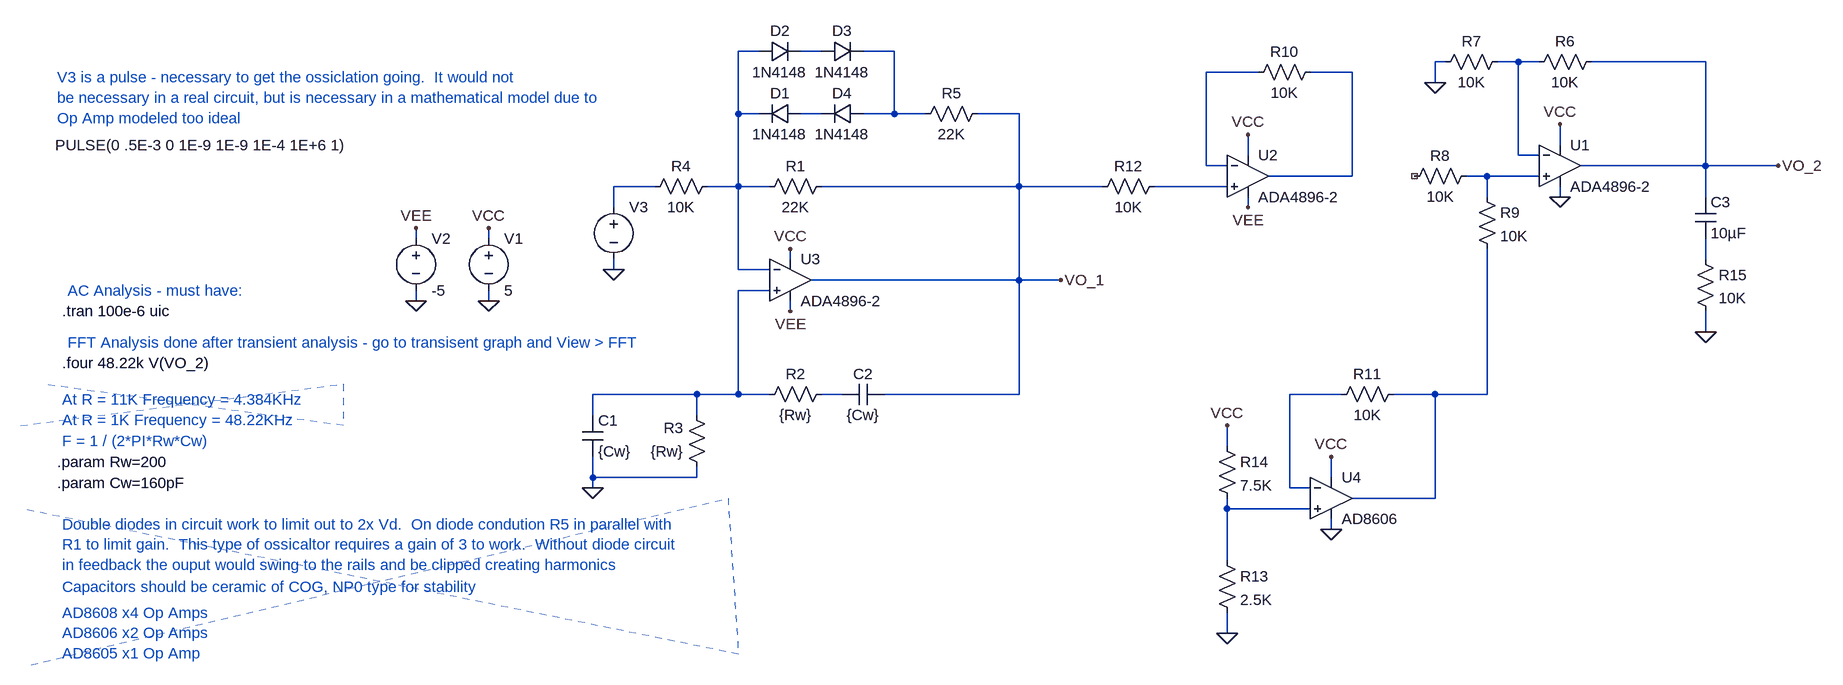
[diagram p0: schematic Wien_Bridge_Offset.asc]
Wien_Bridge_Offset.asc, the LTspice schematic file:
Version 4
SHEET 1 2208 884
WIRE 352 -176 320 -176
WIRE 448 -176 416 -176
WIRE 560 -176 512 -176
WIRE 1408 -160 1392 -160
WIRE 1520 -160 1488 -160
WIRE 1552 -160 1520 -160
WIRE 1808 -160 1632 -160
WIRE 1120 -144 1040 -144
WIRE 1264 -144 1200 -144
WIRE 1392 -128 1392 -160
WIRE 320 -80 320 -176
WIRE 352 -80 320 -80
WIRE 448 -80 416 -80
WIRE 560 -80 560 -176
WIRE 560 -80 512 -80
WIRE 608 -80 560 -80
WIRE 752 -80 688 -80
WIRE 1584 -32 1584 -64
WIRE 1104 -16 1104 -48
WIRE 1520 -16 1520 -160
WIRE 1552 -16 1520 -16
WIRE 1040 0 1040 -144
WIRE 1072 0 1040 0
WIRE 1808 0 1808 -160
WIRE 1808 0 1616 0
WIRE 1920 0 1808 0
WIRE 1264 16 1264 -144
WIRE 1264 16 1136 16
WIRE 1472 16 1440 16
WIRE 1552 16 1472 16
WIRE 192 32 128 32
WIRE 320 32 320 -80
WIRE 320 32 272 32
WIRE 368 32 320 32
WIRE 752 32 752 -80
WIRE 752 32 448 32
WIRE 880 32 752 32
WIRE 1072 32 960 32
WIRE 1472 48 1472 16
WIRE 1584 48 1584 32
WIRE 1808 48 1808 0
WIRE 128 64 128 32
WIRE 1104 64 1104 48
WIRE -176 112 -176 96
WIRE -64 112 -64 96
WIRE 400 144 400 128
WIRE 1808 144 1808 112
WIRE 128 160 128 144
WIRE 320 160 320 32
WIRE 368 160 320 160
WIRE 752 176 752 32
WIRE 752 176 432 176
WIRE 816 176 752 176
WIRE 368 192 320 192
WIRE -176 208 -176 192
WIRE -64 208 -64 192
WIRE 400 224 400 208
WIRE 1808 256 1808 224
WIRE 256 352 96 352
WIRE 320 352 320 192
WIRE 320 352 256 352
WIRE 368 352 320 352
WIRE 480 352 448 352
WIRE 752 352 752 176
WIRE 752 352 544 352
WIRE 1248 352 1168 352
WIRE 1392 352 1328 352
WIRE 1472 352 1472 128
WIRE 1472 352 1392 352
WIRE 96 384 96 352
WIRE 256 384 256 352
WIRE 1072 432 1072 400
WIRE 96 480 96 448
WIRE 256 480 256 464
WIRE 256 480 96 480
WIRE 1232 480 1232 448
WIRE 96 496 96 480
WIRE 1168 496 1168 352
WIRE 1200 496 1168 496
WIRE 1392 512 1392 352
WIRE 1392 512 1264 512
WIRE 1072 528 1072 512
WIRE 1200 528 1072 528
WIRE 1232 560 1232 544
WIRE 1072 608 1072 528
WIRE 1072 720 1072 688
FLAG 400 128 VCC
FLAG -64 96 VCC
FLAG -64 208 0
FLAG 816 176 VO_1
FLAG -176 96 VEE
FLAG -176 208 0
FLAG 400 224 VEE
FLAG 128 160 0
FLAG 96 496 0
FLAG 1584 48 0
FLAG 1584 -64 VCC
FLAG 1392 -128 0
FLAG 1920 0 VO_2
FLAG 1104 -48 VCC
FLAG 1232 560 0
FLAG 1232 448 VCC
FLAG 1072 720 0
FLAG 1072 400 VCC
FLAG 1104 64 VEE
FLAG 1808 256 0
SYMBOL voltage -64 96 R0
WINDOW 123 0 0 Left 0
WINDOW 39 0 0 Left 0
SYMATTR InstName V1
SYMATTR Value 5
SYMBOL res 464 16 R90
WINDOW 0 0 56 VBottom 2
WINDOW 3 32 56 VTop 2
SYMATTR InstName R1
SYMATTR Value 22K
SYMBOL res 464 336 R90
WINDOW 0 0 56 VBottom 2
WINDOW 3 32 56 VTop 2
SYMATTR InstName R2
SYMATTR Value {Rw}
SYMBOL res 272 480 R180
WINDOW 0 36 76 Left 2
WINDOW 3 36 40 Left 2
SYMATTR InstName R3
SYMATTR Value {Rw}
SYMBOL cap 80 384 R0
SYMATTR InstName C1
SYMATTR Value {Cw}
SYMBOL cap 544 336 R90
WINDOW 0 0 32 VBottom 2
WINDOW 3 32 32 VTop 2
SYMATTR InstName C2
SYMATTR Value {Cw}
SYMBOL res 288 16 R90
WINDOW 0 0 56 VBottom 2
WINDOW 3 32 56 VTop 2
SYMATTR InstName R4
SYMATTR Value 10K
SYMBOL voltage -176 96 R0
WINDOW 123 0 0 Left 0
WINDOW 39 0 0 Left 0
SYMATTR InstName V2
SYMATTR Value -5
SYMBOL voltage 128 48 R0
WINDOW 3 -859 -80 Left 2
WINDOW 123 0 0 Left 0
WINDOW 39 0 0 Left 0
SYMATTR Value PULSE(0 .5E-3 0 1E-9 1E-9 1E-4 1E+6 1)
SYMATTR InstName V3
SYMBOL diode 416 -96 R90
WINDOW 0 0 32 VBottom 2
WINDOW 3 32 32 VTop 2
SYMATTR InstName D1
SYMATTR Value 1N4148
SYMBOL diode 352 -160 R270
WINDOW 0 32 32 VTop 2
WINDOW 3 0 32 VBottom 2
SYMATTR InstName D2
SYMATTR Value 1N4148
SYMBOL res 704 -96 R90
WINDOW 0 0 56 VBottom 2
WINDOW 3 32 56 VTop 2
SYMATTR InstName R5
SYMATTR Value 22K
SYMBOL diode 448 -160 R270
WINDOW 0 32 32 VTop 2
WINDOW 3 0 32 VBottom 2
SYMATTR InstName D3
SYMATTR Value 1N4148
SYMBOL diode 512 -96 R90
WINDOW 0 0 32 VBottom 2
WINDOW 3 32 32 VTop 2
SYMATTR InstName D4
SYMATTR Value 1N4148
SYMBOL res 1648 -176 R90
WINDOW 0 0 56 VBottom 2
WINDOW 3 32 56 VTop 2
SYMATTR InstName R6
SYMATTR Value 10K
SYMBOL res 1504 -176 R90
WINDOW 0 0 56 VBottom 2
WINDOW 3 32 56 VTop 2
SYMATTR InstName R7
SYMATTR Value 10K
SYMBOL res 1456 0 R90
WINDOW 0 0 56 VBottom 2
WINDOW 3 32 56 VTop 2
SYMATTR InstName R8
SYMATTR Value 10K
SYMBOL res 1456 32 R0
SYMATTR InstName R9
SYMATTR Value 10K
SYMBOL res 1216 -160 R90
WINDOW 0 0 56 VBottom 2
WINDOW 3 32 56 VTop 2
SYMATTR InstName R10
SYMATTR Value 10K
SYMBOL res 976 16 R90
WINDOW 0 0 56 VBottom 2
WINDOW 3 32 56 VTop 2
SYMATTR InstName R12
SYMATTR Value 10K
SYMBOL res 1344 336 R90
WINDOW 0 0 56 VBottom 2
WINDOW 3 32 56 VTop 2
SYMATTR InstName R11
SYMATTR Value 10K
SYMBOL OpAmps\\AD8606 1232 448 R0
SYMATTR InstName U4
SYMBOL res 1056 592 R0
SYMATTR InstName R13
SYMATTR Value 2.5K
SYMBOL res 1056 416 R0
SYMATTR InstName R14
SYMATTR Value 7.5K
SYMBOL cap 1792 48 R0
SYMATTR InstName C3
SYMATTR Value 10µF
SYMBOL res 1792 128 R0
SYMATTR InstName R15
SYMATTR Value 10K
SYMBOL OpAmps\\ADA4896-2 400 112 R0
SYMATTR InstName U3
SYMBOL OpAmps\\ADA4896-2 1104 -48 R0
SYMATTR InstName U2
SYMBOL OpAmps\\ADA4896-2 1584 -64 R0
SYMATTR InstName U1
TEXT -720 224 Left 2 !.tran 100e-6 uic
TEXT -728 456 Left 2 !.param Rw=200
TEXT -728 488 Left 2 !.param Cw=160pF
TEXT -728 -136 Left 2 ;V3 is a pulse - necessary to get the ossiclation going.  It would not \nbe necessary in a real circuit, but is necessary in a mathematical model due to \nOp Amp modeled too ideal
TEXT -720 648 Left 2 ;Capacitors should be ceramic of COG, NP0 type for stability
TEXT -720 688 Left 2 ;AD8608 x4 Op Amps\nAD8606 x2 Op Amps\nAD8605 x1 Op Amp
TEXT -720 552 Left 2 ;Double diodes in circuit work to limit out to 2x Vd.  On diode condution R5 in parallel with\nR1 to limit gain.  This type of ossicaltor requires a gain of 3 to work.  Without diode circuit\nin feedback the ouput would swing to the rails and be clipped creating harmonics
TEXT -720 424 Left 2 ;F = 1 / (2*PI*Rw*Cw)
TEXT -720 360 Left 2 ;At R = 11K Frequency = 4.384KHz\nAt R = 1K Frequency = 48.22KHz
TEXT -720 304 Left 2 !.four 48.22k V(VO_2)
TEXT -712 192 Left 2 ;AC Analysis - must have:
TEXT -712 272 Left 2 ;FFT Analysis done after transient analysis - go to transisent graph and View > FFT
LINE Normal -288 400 -752 336 2
LINE Normal -288 336 -288 400 2
LINE Normal -784 400 -288 336 2
LINE Normal 320 752 -784 528 2
LINE Normal 304 512 320 752 2
LINE Normal -768 768 304 512 2

The netlist it stands for:
* Wien_Bridge_Offset.asc
V1 VCC 0 5
R1 VO_1 N001 22K
R2 N013 N012 {Rw}
R3 0 N012 {Rw}
C1 N012 0 {Cw}
C2 VO_1 N013 {Cw}
R4 N001 N009 10K
V2 VEE 0 -5
V3 N009 0 PULSE(0 .5E-3 0 1E-9 1E-9 1E-4 1E+6 1)
D1 N007 N001 1N4148
D2 N001 N002 1N4148
R5 VO_1 N003 22K
D3 N002 N003 1N4148
D4 N003 N007 1N4148
R6 VO_2 N004 10K
R7 N004 0 10K
R8 N008 NC_01 10K
R9 N008 N015 10K
R10 N006 N005 10K
R12 N010 VO_1 10K
R11 N015 N014 10K
XU4 N016 N014 VCC 0 N015 AD8606  ; pins In+ In- V+ V- OUT
R13 N016 0 2.5K
R14 VCC N016 7.5K
C3 VO_2 N011 10µF
R15 N011 0 10K
XU3 N012 N001 VCC VEE VO_1 ADA4896-2  ; pins In+ In- V+ V- OUT
XU2 N010 N005 VCC VEE N006 ADA4896-2  ; pins In+ In- V+ V- OUT
XU1 N008 N004 VCC 0 VO_2 ADA4896-2  ; pins In+ In- V+ V- OUT
.model D D
.lib standard.dio
.tran 100e-6 uic
.param Rw=200
.param Cw=160pF
* V3 is a pulse - necessary to get the ossiclation going.  It would not
* be necessary in a real circuit, but is necessary in a mathematical model due to
* Op Amp modeled too ideal
* Capacitors should be ceramic of COG, NP0 type for stability
* AD8608 x4 Op Amps
* AD8606 x2 Op Amps
* AD8605 x1 Op Amp
* Double diodes in circuit work to limit out to 2x Vd.  On diode condution R5 in parallel with
* R1 to limit gain.  This type of ossicaltor requires a gain of 3 to work.  Without diode circuit
* in feedback the ouput would swing to the rails and be clipped creating harmonics
* F = 1 / (2*PI*Rw*Cw)
* At R = 11K Frequency = 4.384KHz
* At R = 1K Frequency = 48.22KHz
.four 48.22k V(VO_2)
* AC Analysis - must have:
* FFT Analysis done after transient analysis - go to transisent graph and View > FFT
.lib ADI.lib
.lib ADA4896-2.lib
.backanno
.end